# Altium project 20230531.PrjPcb
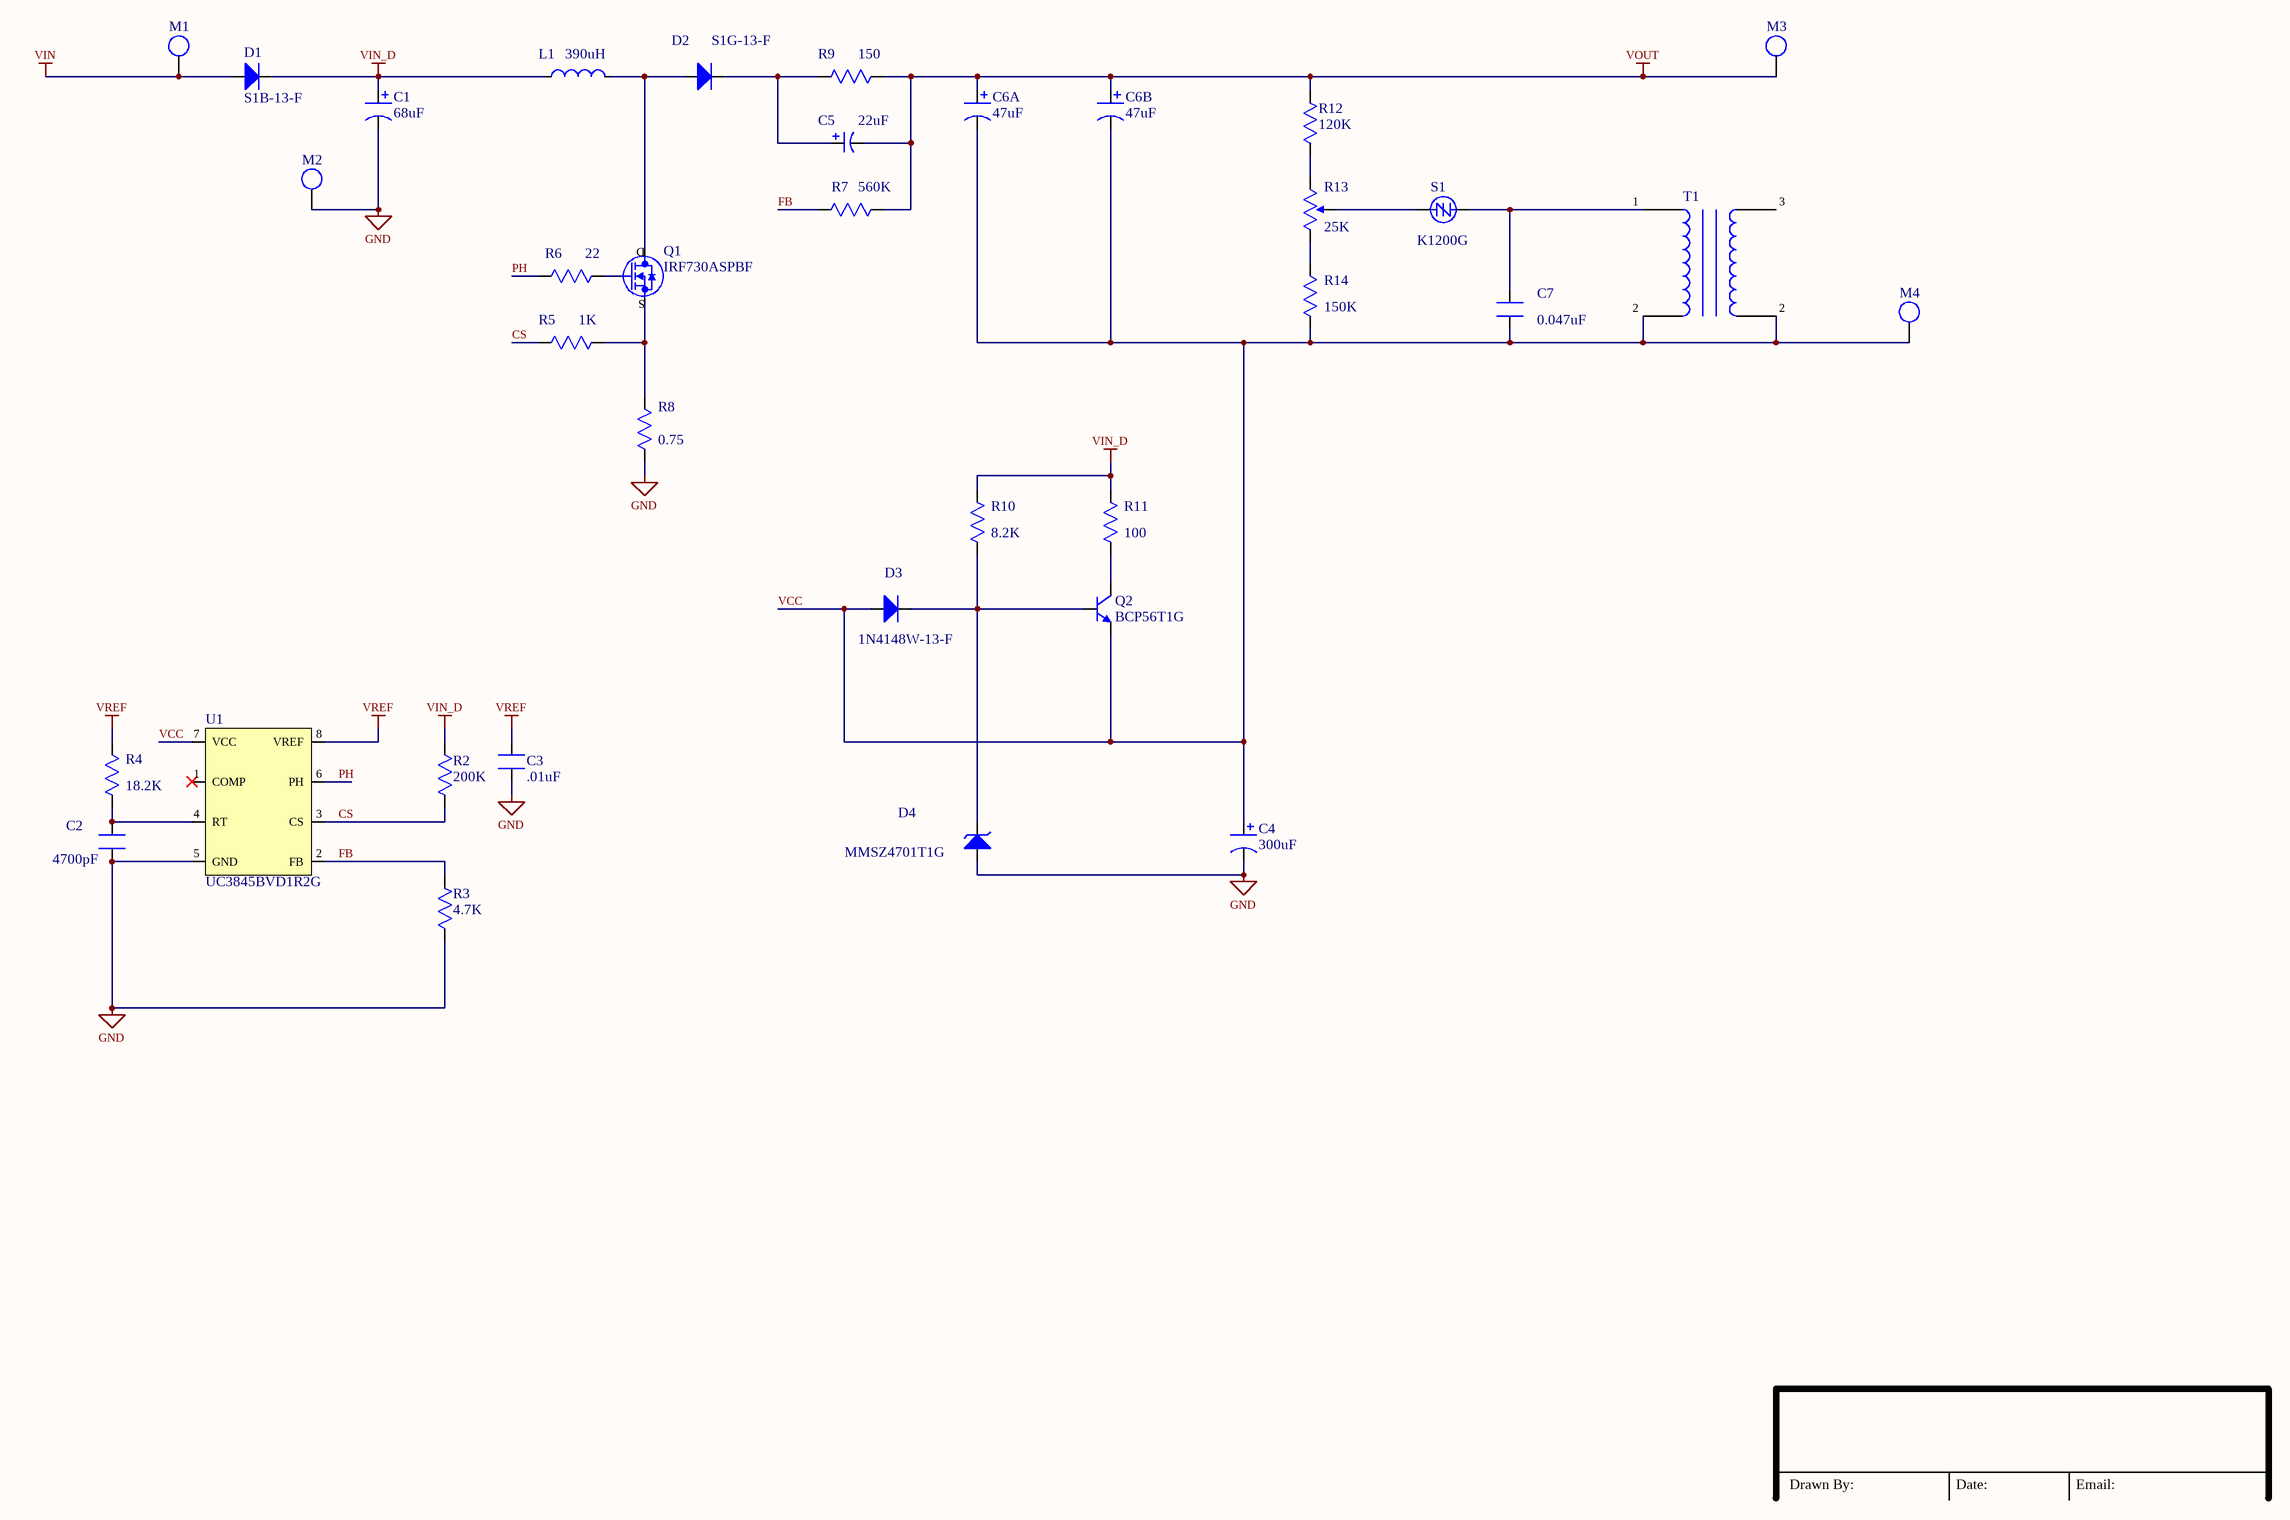
[diagram p0: 20230531_Sheet1.SchDoc]
1 sheet, 36 parts. Net scope: global (net labels, ports and power ports of the same name join across sheets).
Board file: 20230531.PcbDoc

## Sheet 20230531_Sheet1.SchDoc
size C; Date: 05/31/2023; DrawnBy: Garrett Black; SheetNumber: 1; SheetTotal: 1; Email: contact@rgb.engineering

### Parts
*  TITLE_BLOCK  (value not drawn)
C1  68uF  [CAP_POL_13.5_13.5]
C2  4700pF  [CAP_0603]
C3  .01uF  [CAP_0603]
C4  300uF  [CAP_POL_10.3_10.3]
C5  22uF  [CAP_POL_2917]
C6A  47uF  [CAP_POL_16.3_16.3]
C6B  47uF  [CAP_POL_16.3_16.3]
C7  0.047uF  [CAP_15MM]
D1  S1B-13-F  [DIO_214AC]
D2  S1G-13-F  [DIO_214AC]
D3  1N4148W-13-F  [DIO_SOD123]
D4  MMSZ4701T1G  [DIO_SOD123]
L1  390uH  [IND_12.5_12.5]
M1  2MM  [MOUNTING_HOLE_M2]  (value not drawn)
M2  2MM  [MOUNTING_HOLE_M2]  (value not drawn)
M3  2MM  [MOUNTING_HOLE_M2]  (value not drawn)
M4  2MM  [MOUNTING_HOLE_M2]  (value not drawn)
Q1  IRF730ASPBF  [FET_TO-263-3]
Q2  BCP56T1G  [TRANS_SOT-223]
R2  200K  [RES_1206]
R3  4.7K  [RES_1206]
R4  18.2K  [RES_1206]
R5  1K  [RES_1206]
R6  22  [RES_1206]
R7  560K  [RES_1206]
R8  0.75  [RES_1206]
R9  150  [RES_1206]
R10  8.2K  [RES_1206]
R11  100  [RES_1206]
R12  120K  [RES_1206]
R13  25K  [POT_]
R14  150K  [RES_1206]
S1  K1200G  [SIDAC_TH1]
T1  COMP-0433  [XFMR_Custom2]  (value not drawn)
U1  UC3845BVD1R2G  [IC_8_SOIC]

### Nets
GND: C1.2 C2.2 C3.2 C4.2 D4.2(A) M2.1 R3.1 R8.1 U1.5(GND)
VIN: D1.2(A) M1.1
VIN_D: C1.1 D1.1(K) L1.1 R2.2 R10.2 R11.2
VOUT: C5.2 C6A.1 C6B.1 M3.1 R7.2 R9.2 R12.2
VREF: C3.1 R4.2 U1.8(VREF)
CS: R2.1 R5.1 U1.3(CS)
FB: R3.2 R7.1 U1.2(FB)
PH: R6.1 U1.6(PH)
VCC: C4.1 C6A.2 C6B.2 C7.2 D3.2(A) M4.1 Q2.2(E) R14.1 T1.2 U1.7(VCC)
NetC2_1: C2.1 R4.1 U1.4(RT)
NetC5_1: C5.1 D2.1(K) R9.1
NetC7_1: C7.1 S1.2 T1.1
NetD2_2: D2.2(A) L1.2 Q1.2(D)
NetD3_1: D3.1(K) D4.1(A) Q2.1(B) R10.1
NetQ1_1: Q1.1(G) R6.2
NetQ1_3: Q1.3(S) R5.2 R8.2
NetQ2_3: Q2.3(C) R11.1
NetR12_1: R12.1 R13.1
NetR13_2: R13.2 S1.1
NetR13_3: R13.3 R14.2

Not connected (* = marked no-connect by the designer): T1 3; U1 1(COMP)*

### Notes on the sheet
- (near *) Drawn By:
- Date:
- Email:

### Library data of the parts
C1 = COMP-0413: CAP, 68uF, 100V, 20%, AL; Manufacturer: Panasonic Electronic Components; MPN: EEE-FK2A680AQ
C2 = COMP-0411: CAP, 4700pF, 50V, 1%, X5R, 0603; Manufacturer: TDK Corporation; MPN: CGA3E2C0G1H472J080AA
C3 = COMP-0006: CAP, 0.01uF, 50V, 10%, X7R, 0603; Manufacturer: Samsung Electro-Mechanics; MPN: CL10B103KB8NNNL
C4 = COMP-0335: CAP, 330uF, 35V, RAD 10.3mm x 10.3mm; Manufacturer: KEMET; MPN: A771MS337M1VLAS014
C5 = COMP-0412: CAP, 22uF, 50V, 20%, TANT; Manufacturer: KEMET; MPN: T491X226M050AT
C6A C6B = COMP-0420: CAP, 47uF, 250V, 20%, AL; Manufacturer: KEMET; MPN: EDH476M250A9TAA
C7 = COMP-0422: CAP, 0.047uF, 630V, 15MM; Manufacturer: KEMET; MPN: R76PI24705050J
D1 = COMP-0415: DIO, 100V, 1A; Manufacturer: Diodes Incorporated; MPN: S1B-13-F
D2 = COMP-0416: DIO, 400V, 1A; Manufacturer: Diodes Incorporated; MPN: S1G-13-F
D3 = COMP-0421: DIO, 100V, 300mA; Manufacturer: Diodes Incorporated; MPN: 1N4148W-13-F
D4 = COMP-0417: DIO, ZENER, 14V; Manufacturer: onsemi; MPN: MMSZ4701T1G
L1 = COMP-0419: IND, 390uH, 1A; Manufacturer: Bourns Inc.; MPN: SRR1280-391K
M1-M4 = MT_M2: Mounting hole, size M2
Q1 = COMP-0418: TRANS, N-CH,  400V, 5.5A, 74W; Manufacturer: Vishay Siliconix; MPN: IRF730ASPBF
Q2 = COMP-0414: TRANS, NPN, 80V, 1A; Manufacturer: onsemi; MPN: BCP56T1G
R2 = COMP-0407: RES, 200KOHM, 1%, 1/4W, 1206; Manufacturer: YAGEO; MPN: RC1206FR-07200KL
R3 = COMP-0402: RES, 4.7KOHM, 1%, 1/4W, 1206; Manufacturer: YAGEO; MPN: RC1206FR-134K7L
R4 = COMP-0405: RES, 18.2KOHM, 1%, 1/4W, 1206; Manufacturer: YAGEO; MPN: RC1206FR-0718K2L
R5 = COMP-0400: RES, 1KOHM, 1%, 1/4W, 1206; Manufacturer: YAGEO; MPN: RC1206FR-071KL
R6 = COMP-0403: RES, 22OHM, 1%, 1/4W, 1206; Manufacturer: YAGEO; MPN: RC1206FR-1022RL
R7 = COMP-0404: RES, 560KOHM, 1%, 1/4W, 1206; Manufacturer: YAGEO; MPN: RC1206FR-07560KL
R8 = COMP-0410: RES, 0.75OHM, 1%, 1W, 1206; Manufacturer: YAGEO; MPN: PE1206FRF470R75L
R9 = COMP-0409: RES, 150OHM, 1%, 1/2W, 1206; Manufacturer: Vishay Dale; MPN: CRCW1210150RFKEA
R10 = COMP-0408: RES, 8.2KOHM, 1%, 1/4W, 1206; Manufacturer: YAGEO; MPN: RC1206FR-078K2L
R11 = COMP-0399: RES, 100OHM, 1/4W, 1%, 1206; Manufacturer: YAGEO; MPN: RC1206FR-13100RL
R12 = COMP-0401: RES, 120KOHM, 1%, 1/4W, 1206; Manufacturer: YAGEO; MPN: RC1206FR-07120KL
R13 = COMP-0434: POT, 25KOHM; Manufacturer: Bourns Inc.; MPN: 3361P-1-253GLF
R14 = COMP-0406: RES, 150KOHM, 1%, 1/4W, 1206; Manufacturer: YAGEO; MPN: RC1206FR-07150KL
S1 = COMP-0435: SIDAC, 125V, 150mA
T1 = COMP-0433: XFMR, TRIGGER
U1 = COMP-0398: IC, POWER MGMT, BOOST REGULATOR, 30V, 105C, SOIC-8; Manufacturer: onsemi; MPN: UC3845BVD1R2G

## Assembly variants
20230531-0011: all parts fitted